# EAGLE schematic TeensyLogger (EAGLE 6.5.0)
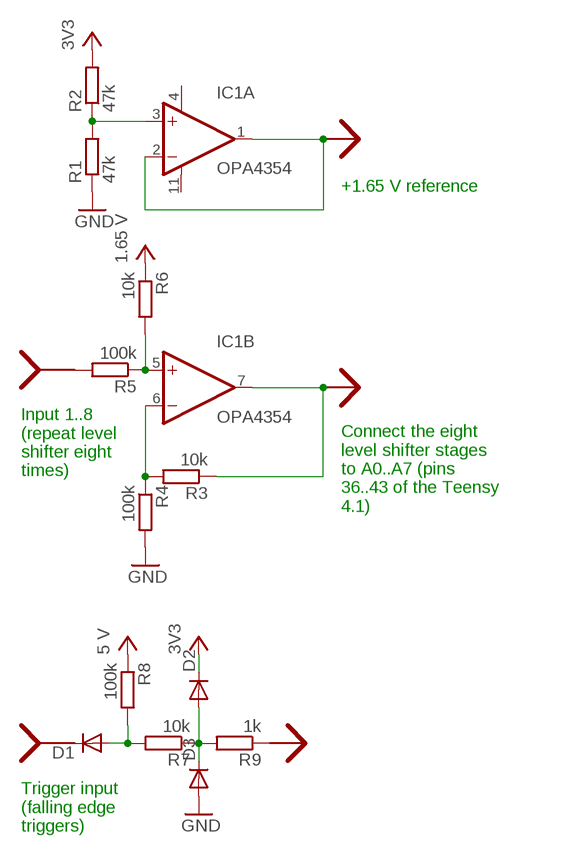
[diagram p0: schematic, sheet 1]

## Parts
D1  1N4148DO35-7  [DO35-7]
D2  1N4148DO35-7  [DO35-7]
D3  1N4148DO35-7  [DO35-7]
IC1  OPA4354  OPA4234U  [SO14]
R1  47k  R-EU_0204/2V  [0204V]
R2  47k  R-EU_0204/2V  [0204V]
R3  10k  R-EU_0204/2V  [0204V]
R4  100k  R-EU_0204/2V  [0204V]
R5  100k  R-EU_0204/2V  [0204V]
R6  10k  R-EU_0204/2V  [0204V]
R7  10k  R-EU_0204/2V  [0204V]
R8  100k  R-EU_0204/2V  [0204V]
R9  1k  R-EU_0204/2V  [0204V]
U$1  OUTPUT_CONNECTOR_1  [ONE_O]
U$2  OUTPUT_CONNECTOR_1  [ONE_O]
U$3  INPUT_CONNECTOR  [ONE_O]
U$4  INPUT_CONNECTOR  [ONE_O]
U$5  OUTPUT_CONNECTOR_1  [ONE_O]

## Nets
GND: D3.A R1.1 R4.2
N$1: IC1.1(A:OUT) IC1.2(A:-IN) U$1.P$1
N$2: IC1.3(A:+IN) R1.2 R2.1
N$3: IC1.6(B:-IN) R3.2 R4.1
N$4: IC1.7(B:OUT) R3.1 U$2.P$1
N$5: IC1.5(B:+IN) R5.1 R6.2
N$6: R5.2 U$3.P$1
N$7: D1.C U$4.P$1
N$8: D1.A R7.2 R8.2
N$9: D2.A D3.C R7.1 R9.2
N$10: R9.1 U$5.P$1
VCC: D2.C R2.2 R6.1 R8.1 ; supply symbol labelled 3V3, 1.65 V, 5 V
Unconnected: IC1.8(C:OUT) IC1.9(C:-IN) IC1.10(C:+IN) IC1.12(D:+IN) IC1.13(D:-IN) IC1.14(D:OUT)

## Notes on the sheet
- +1.65 V reference
- Input 1..8
  (repeat level
  shifter eight
  times)
- Connect the eight 
  level shifter stages
  to A0..A7 (pins
  36..43 of the Teensy 
  4.1)
- Trigger input
  (falling edge
  triggers)

## Power pins joined to a net without a drawn wire
V+: IC1.4(A:V+)
V-: IC1.11(A:V-)

## Library data of the parts
D1-D3 = diode:1N4148: DIODE high speed (Philips)
IC1 = burr-brown:OPA4234: Low Power, Precision Single-Supply Operational Amplifiers; MF: TEXAS INSTRUMENTS; MPN: OPA4234U; OC_FARNELL: 1207058; OC_NEWARK: 75C4965
R1-R9 = rcl:R-EU_: RESISTOR, European symbol
U$1 U$2 U$5 = analog-computer:OUTPUT_CONNECTOR_1: Output connector
U$3 U$4 = analog-computer:INPUT_CONNECTOR: Input connector